# Altium schematic sheet Sheet1.schdoc
size A; SheetNumber: 1; SheetTotal: 1
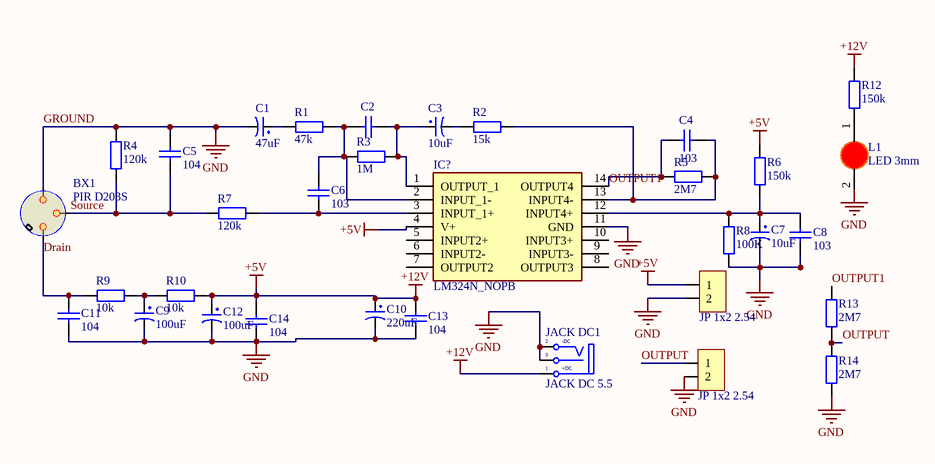
[diagram p0: Sheet1.schdoc]

## Parts
BX1  PIR D203S  [BXR315A]
C1  47uF  [tu hoa 5mm]
C2  103  [tu gom]  (value not drawn)
C3  10uF  [tu hoa 4mm]
C4  103  [tu gom]
C5  104  [tu gom]
C6  103  [tu gom]
C7  10uF  [tu hoa 4mm]
C8  103  [tu gom]
C9  100uF  [tu hoa 5mm]
C10  220uF  [tu hoa 6.5mm]
C11  104  [tu gom]
C12  100uF  [tu hoa 5mm]
C13  104  [tu gom]
C14  104  [tu gom]
IC?  LM324N_NOPB  [DIP794W56P254L1905H533Q14N]
JACK_DC1  JACK DC 5.5  [JACK DC 5.5]
JP1  JP 1x2 2.54  [JP 1x2 DT]
JP2  JP 1x2 2.54  [JP 1x2 DT]
L1  LED 3mm  [LED-3MM-RED]
R1  47k  [tro vach 1/4w]
R2  15k  [tro vach 1/4w]
R3  1M  [tro vach 1/4w]
R4  120k  [tro vach 1/4w]
R5  2M7  [tro vach 1/4w]
R6  150k  [Tro vach 1/4w]
R7  120k  [tro vach 1/4w]
R8  100K  [tro vach 1/4w]
R9  10k  [tro vach 1/4w]
R10  10k  [tro vach 1/4w]
R12  150k  [Tro vach 1/4w]
R13  2M7  [tro vach 1/4w]
R14  2M7  [tro vach 1/4w]

## Nets
+12V: C10.1 C12.1 C13.1 C14.1 IC?.4(V+) JACK_DC1.1(T) JP2.1 R6.2 R10.2 R12.2  [also labelled +5V]
GROUND: BX1.3 C1.2 C5.1 C7.2 C8.1 C9.2 C10.2 C11.2 C12.2 C13.2 C14.2 IC?.11(GND) JACK_DC1.2(TN) JACK_DC1.3(S) JP1.2 JP2.2 L1.2(K) R4.2 R8.1 R14.1  [also labelled GND]
Drain: BX1.1(D) C11.1 R9.1
OUTPUT: JP1.1 R13.1 R14.2
OUTPUT1: C4.2 IC?.14(OUTPUT4) R5.1 R13.2
Source: BX1.2 C5.2 R4.1 R7.1
NetC1_1: C1.1 R1.1
NetC2_1: C2.1 C6.2 IC?.2(INPUT_1-) R1.2 R3.1
NetC2_2: C2.2 C3.1 IC?.1(OUTPUT_1) R3.2
NetC3_2: C3.2 R2.1
NetC4_1: C4.1 IC?.13(INPUT4-) R2.2 R5.2
NetC6_1: C6.1 IC?.3(INPUT_1+) R7.2
NetC7_1: C7.1 C8.2 IC?.12(INPUT4+) R6.1 R8.2
NetC9_1: C9.1 R9.2 R10.1
NetL1_1: L1.1(A) R12.1

Not connected (* = marked no-connect by the designer): IC? 5(INPUT2+) 6(INPUT2-) 7(OUTPUT2) 8(OUTPUT3) 9(INPUT3-) 10(INPUT3+)

## Notes on the sheet
- (in symbol JACK DC 5.5) -DC; +DC

## Library data of the parts
C1 = Tu Hoa 47uF 16V 5x10: Cắm; Don_Vi: Con; So_Chan: 2; Ten_Linh_Kien: Tụ Hóa 47uF 16V; Ma_Hang: MH006859; Chung_Loai: Cắm; Kieu_Chan: *
C2 C4 C6 C8 = Tu gom 103 50V: Cắm; So_Chan: 2; Ten_Linh_Kien: Tụ gốm 103 10nF 50V; Don_Vi: Con; Ma_Hang: MH000936; Chung_Loai: Cắm; Kieu_Chan: *
C3 C7 = Tu Hoa 10uF 16V 4x7: Cắm; So_Chan: 2; Don_Vi: Con; Ten_Linh_Kien: Tụ Hóa 10uF 16V; Ma_Hang: MH006855; Chung_Loai: Cắm; Kieu_Chan: *
C5 C11 C13 C14 = Tu gom 104 50V: Cắm; So_Chan: 2; Ten_Linh_Kien: Tụ gốm 104 100nF 50V; Don_Vi: Con; Ma_Hang: MH004761; Chung_Loai: Cắm; Kieu_Chan: *
C9 C12 = Tu Hoa 100uF 16V 5x11: Cắm; Don_Vi: Con; So_Chan: 2; Ten_Linh_Kien: Tụ Hóa 100uF 16V 5x11MM; Ma_Hang: MH008417; Chung_Loai: Cắm; Kieu_Chan: *
C10 = Tu Hoa 220uF 16V 7x11: Cắm; Don_Vi: Con; Ten_Linh_Kien: Tụ Hóa 220uF 16V 7x11MM; So_Chan: 2; Ma_Hang: MH008416; Chung_Loai: Cắm; Kieu_Chan: *
IC? = LM324N_NOPB: Integrated Circuit; Manufacturer_Name: Texas Instruments; Manufacturer_Part_Number: LM324N/NOPB; Datasheet Link: http://www.ti.com/general/docs/lit/getliterature.tsp?genericPartNumber=LM324-N&fileType=pdf&HQS=ti-null-null-sf-df-pf-sep-wwe&DCM=yes; Height: 5.334mm; Mouser Part Number: 926-LM324N/NOPB; Mouser Price/Stock: https://www.mouser.co.uk/ProductDetail/Texas-Instruments/LM324N-NOPB?qs=X1J7HmVL2ZGOUbLumEeh2Q%3D%3D; Arrow Part Number: LM324N/NOPB; Arrow Price/Stock: https://www.arrow.com/en/products/lm324nnopb/texas-instruments?region=nac
JACK_DC1 = JACK DC 5.5: Value: Jac DC
JP1 JP2 = JP 1x2 2.54 Duc Thang: Cắm; Ten_Linh_Kien: Jump Đơn Đực 2.54MM 1x40P Thẳng 11MM; Don_Vi: Con; Ma_Hang: MH000903; Ghi_Chu: *; Kieu_Chan: *; Chung_Loai: Cắm
L1 = LED 3mm Do: Cắm; Don_Vi: Con; Ma_Hang: MH003892; Ten_Linh_Kien: Led 3MM Phủ Đỏ (10c); Ghi_Chu: *; Kieu_Chan: *; Chung_Loai: Cắm
R1-R5 R7-R10 R13 R14 = Tro Vach 1/4W 1%  120k: Cắm; Don_Vi: Con; Ten_Linh_Kien: Trở Vạch 1/4W 1% 120k; So_Chan: 2; Ma_Hang: MH008833; Chung_Loai: Cắm; Kieu_Chan: *
R6 R12 = Tro Vach 1/4W 5% 150k: Cắm; Don_Vi: Con; So_Chan: 2; Ten_Linh_Kien: Trở Vạch 1/4w 5% 150k; Ma_Hang: MH007286; Chung_Loai: Cắm; Kieu_Chan: *